# EAGLE design PCM2704_Test_v1 (EAGLE 6.4)
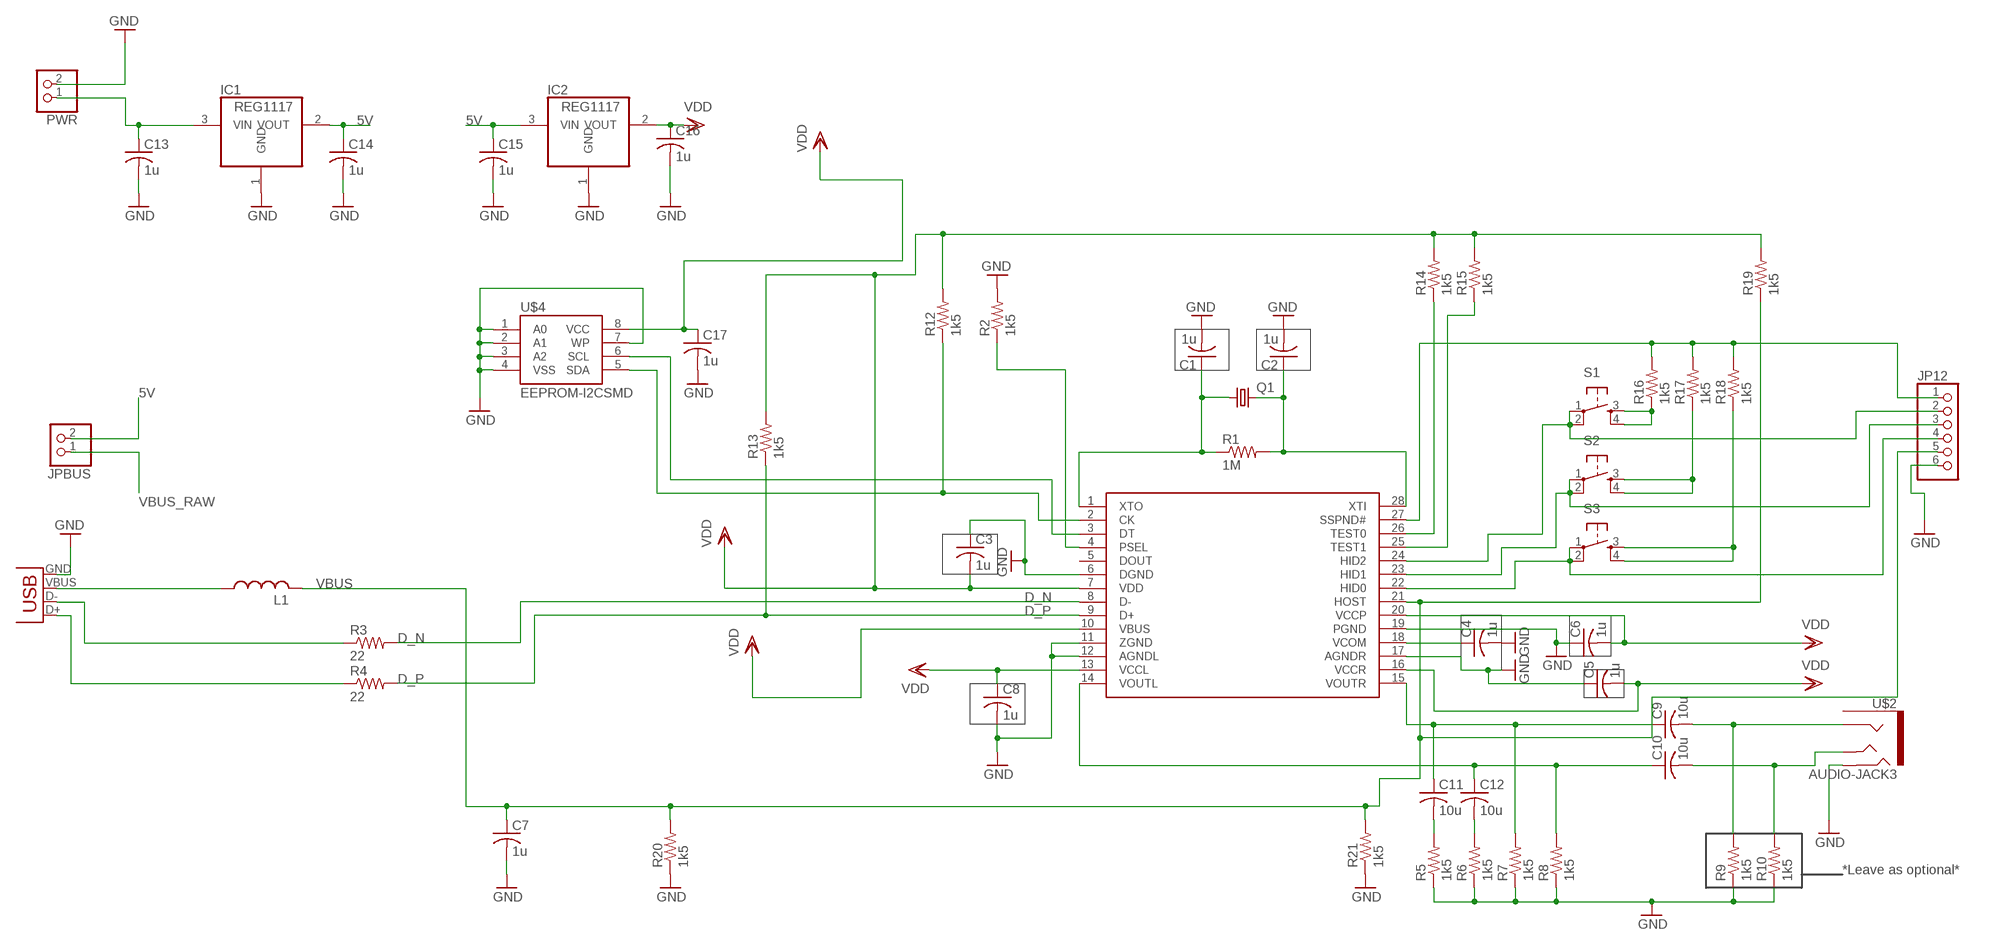
[diagram p0: schematic, sheet 1]

## Parts
C1  1u  C-USC0402  [C0402]
C2  1u  C-USC0402  [C0402]
C3  1u  C-USC0402  [C0402]
C4  1u  C-USC0402  [C0402]
C5  1u  C-USC0402  [C0402]
C6  1u  C-USC0402  [C0402]
C7  1u  C-USC0402  [C0402]
C8  1u  C-USC0402  [C0402]
C9  10u  C-USC0805  [C0805]
C10  10u  C-USC0805  [C0805]
C11  10u  C-USC0805  [C0805]
C12  10u  C-USC0805  [C0805]
C13  1u  C-USC0805  [C0805]
C14  1u  C-USC0805  [C0805]
C15  1u  C-USC0805  [C0805]
C16  1u  C-USC0805  [C0805]
C17  1u  C-USC0402  [C0402]
IC1  REG1117  [SOT223]
IC2  REG1117  [SOT223]
JP12  PINHD-1X6  [1X06]
JPBUS  PINHD-1X2  [1X02]
L1  L-USL3225M  [L3225M]
PWR  PINHD-1X2  [1X02]
Q1  CRYSTALHC49US  [HC49US]
R1  1M  R-US_R0603  [R0603]
R2  1k5  R-US_R0603  [R0603]
R3  22  R-US_R0603  [R0603]
R4  22  R-US_R0603  [R0603]
R5  1k5  R-US_R0805  [R0805]
R6  1k5  R-US_R0805  [R0805]
R7  1k5  R-US_R0805  [R0805]
R8  1k5  R-US_R0805  [R0805]
R9  1k5  R-US_R0805  [R0805]
R10  1k5  R-US_R0805  [R0805]
R12  1k5  R-US_R0603  [R0603]
R13  1k5  R-US_R0603  [R0603]
R14  1k5  R-US_R0603  [R0603]
R15  1k5  R-US_R0603  [R0603]
R16  1k5  R-US_R0603  [R0603]
R17  1k5  R-US_R0603  [R0603]
R18  1k5  R-US_R0603  [R0603]
R19  1k5  R-US_R0603  [R0603]
R20  1k5  R-US_R0603  [R0603]
R21  1k5  R-US_R0603  [R0603]
S1  TAC_SWITCHSMD  [TACTILE_SWITCH_SMD]
S2  TAC_SWITCHSMD  [TACTILE_SWITCH_SMD]
S3  TAC_SWITCHSMD  [TACTILE_SWITCH_SMD]
U$1  PCM2704C  [PCM2704C]
U$2  AUDIO-JACK3  [AUDIO-JACK-TRRS-SMD]
U$4  EEPROM-I2CSMD  [SO08]
X1  USB-MB-S  [USB-MB-S]

## Nets
5V: C14.1 C15.1 IC1.2(VOUT) IC2.3(VIN) JPBUS.2
D_N: R3.2 U$1.8(D-)
D_P: R4.2 R13.1 U$1.9(D+)
GND: C1.2 C2.2 C3.1 C4.2 C5.1 C6.1 C7.2 C8.2 C13.2 C14.2 C15.2 C16.2 C17.2 IC1.1(GND) IC2.1(GND) JP12.6 PWR.2 R2.2 R5.1 R6.1 R7.1 R8.1 R9.1 R10.1 R20.1 R21.1 U$1.6(DGND) U$1.11(ZGND) U$1.12(AGNDL) U$1.17(AGNDR) U$1.19(PGND) U$2.RING2 U$4.1(A0) U$4.2(A1) U$4.3(A2) U$4.4(VSS) U$4.7(WP) X1.GND
HP_OUT_L: C10.2 R10.2 U$2.TIP
HP_OUT_R: C9.2 R9.2 U$2.RING1
N$1: C1.1 Q1.1 R1.1 U$1.1(XTO)
N$2: C2.1 Q1.2 R1.2 U$1.28(XTI)
N$5: R2.1 U$1.4(PSEL)
N$8: R16.1 S1.3 S1.4
N$10: R17.1 S2.3 S2.4
N$11: R18.1 S3.3 S3.4
N$14: R14.1 U$1.26(TEST0)
N$15: R15.1 U$1.25(TEST1)
N$16: R12.1 U$1.2(CK) U$4.5(SDA)
N$17: U$1.3(DT) U$4.6(SCL)
N$18: C4.1 U$1.18(VCOM)
N$19: C11.2 R5.2
N$20: C12.2 R6.2
N$22: JP12.4 S3.1 S3.2 U$1.22(HID0)
N$23: JP12.3 S2.1 S2.2 U$1.23(HID1)
N$24: JP12.2 S1.1 S1.2 U$1.24(HID2)
SSPND: JP12.1 R16.2 R17.2 R18.2 U$1.27(SSPND#)
USB_D_N: R3.1 X1.D-
USB_D_P: R4.1 X1.D+
VBUS: C7.1 JP12.5 L1.2 R19.1 R20.2 R21.2 U$1.21(HOST)
VBUS_RAW: JPBUS.1 L1.1 X1.VBUS
VDD: C3.2 C5.2 C6.2 C8.1 C16.1 C17.1 IC2.2(VOUT) R12.2 R13.2 R14.2 R15.2 R19.2 U$1.7(VDD) U$1.10(VBUS) U$1.13(VCCL) U$1.16(VCCR) U$1.20(VCCP) U$4.8(VCC)
VIN: C13.1 IC1.3(VIN) PWR.1
VOUTL: C10.1 C12.1 R8.2 U$1.14(VOUTL)
VOUTR: C9.1 C11.1 R7.2 U$1.15(VOUTR)
Unconnected: U$1.5(DOUT) U$2.EARTH

## Notes on the sheet
- *Leave as optional*

## Library data of the parts
C1-C17 = rcl:C-US: CAPACITOR, American symbol
IC1 IC2 = burr-brown-3:REG1117: 800mA and 1A Low Dropout (LDO) Positive Regulator 1.8V, 2.5V, 2.85V, 3.3V, 5V, and Adj
JP12 = pinhead:PINHD-1X6: PIN HEADER
JPBUS PWR = pinhead:PINHD-1X2: PIN HEADER
L1 = rcl:L-US: INDUCTOR, American symbol
Q1 = SparkFun-FreqCtrl:CRYSTAL: Various standard crystals. Proven footprints. Spark Fun Electronics SKU : COM-00534
R1-R10 R12-R21 = rcl:R-US_: RESISTOR, American symbol
S1-S3 = SparkFun:TAC_SWITCH: Momentary Switch Button commonly used for reset or general input. Spark Fun Electronics SKU : COM-00097
U$1 = pcm2704c:PCM2704C
U$2 = SparkFun-Connectors:AUDIO-JACK3: Audio jack - 3.5mm TRRS variety - two rings.
U$4 = SparkFun:EEPROM-I2C
X1 = con-usb:USB: USB Connectors

## Board
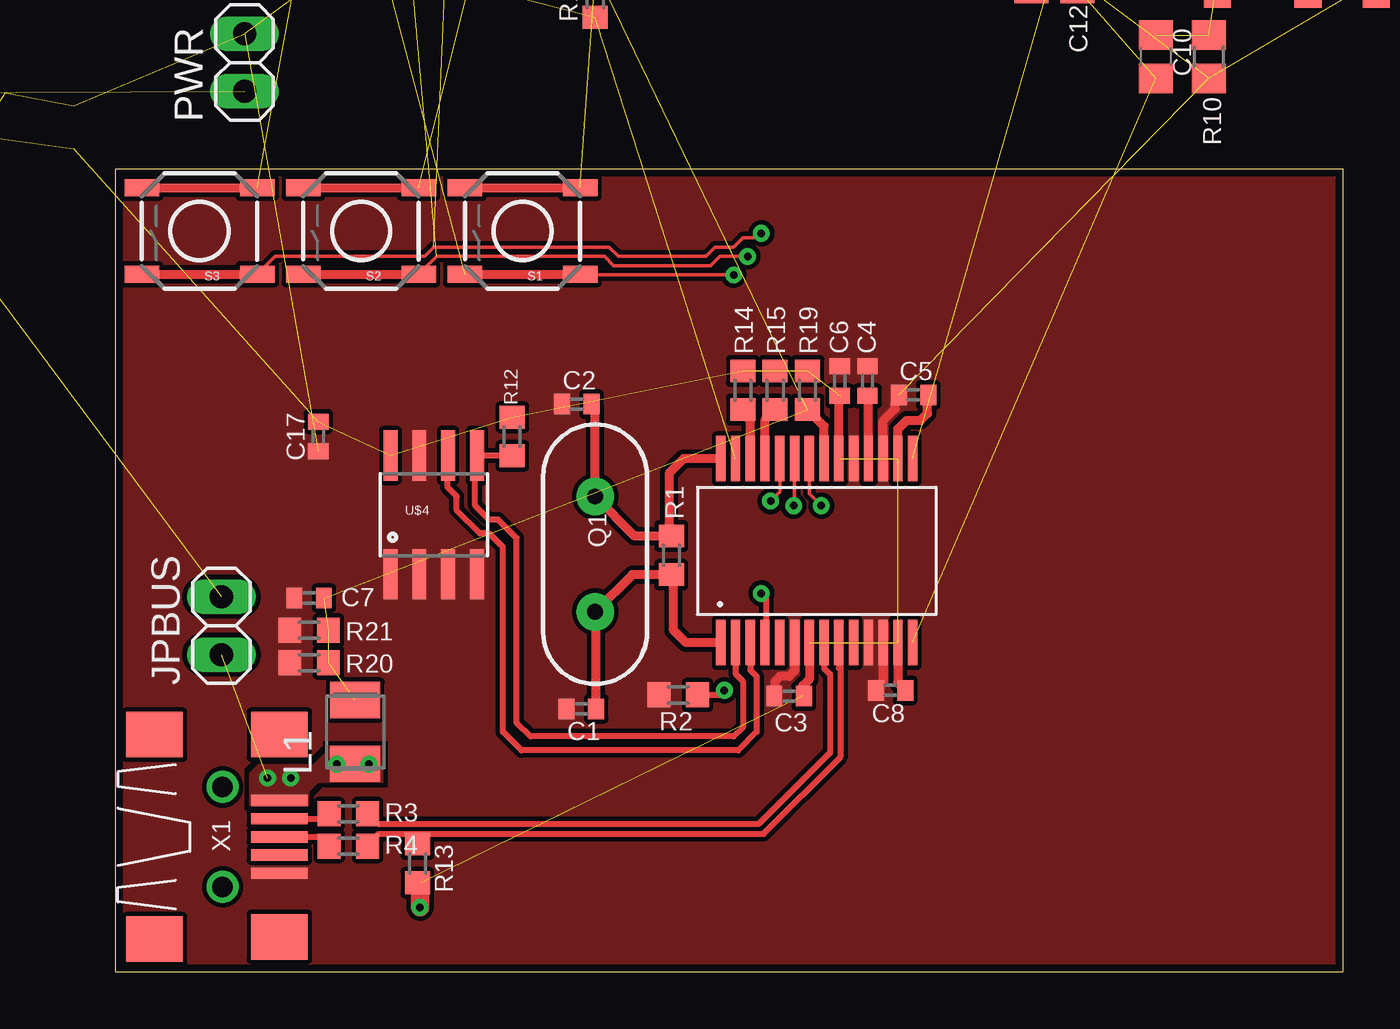
[diagram p1: board, top side]
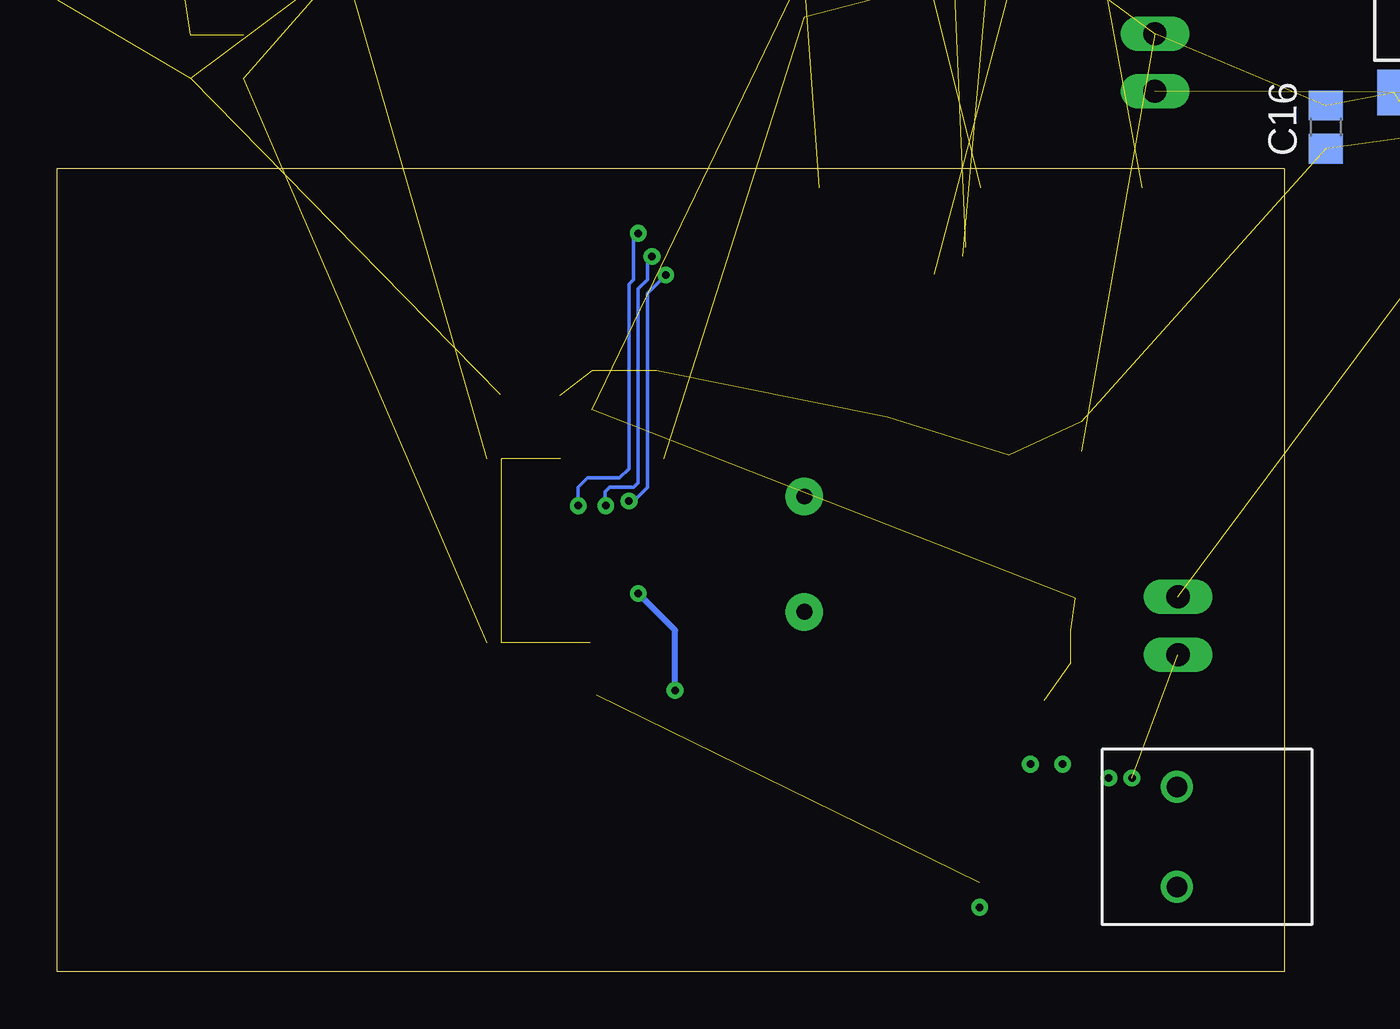
[diagram p2: board, bottom side, seen from below]

Size 54.05 x 35.36 mm. Coordinates in mm from the lower left corner, seen from the top.
Outline: 0,0 54.05,0 54.05,35.36 0,35.36 0,0
Copper layers (1*16): Top 0.035mm / dielectric 1.5mm / Bottom 0.035mm
Design rules "default *": minimum track width 10mil, minimum drill 24mil, track to track 8mil, track to pad 8mil, pad to pad 8mil, via to via 8mil, smd to smd 8mil, copper to edge 13mil, drill to drill 8mil, minimum pad ring 10mil, minimum via ring 8mil, stop-mask expansion 4mil, vias tented up to drill 0mil, thermal gap 10mil

### Footprints (pad centres in the part's own frame; a part is rotated, then mirrored left to right if it is on the bottom)
C0402 = smd 0.7 x 0.9: 1 -0.65,0; 2 0.65,0
C0805 = smd 1.3 x 1.5: 1 -0.95,0; 2 0.95,0
SOT223 = smd 1.499 x 2.007: 1 -2.261,-3.15; 2 0.025,-3.15; 3 2.311,-3.15 | smd 3.81 x 2.007: 4 0,3.15
1X06 = drill 1.016 long: 1 -6.35,0; 2 -3.81,0; 3 -1.27,0; 4 1.27,0; 5 3.81,0; 6 6.35,0
1X02 = drill 1.016 long: 1 -1.27,0; 2 1.27,0
L3225M = smd 1.6 x 2.2: 1 -1.4,0; 2 1.4,0
HC49US = drill 0.7 pad 1.651: 1 -2.54,0; 2 2.54,0
R0603 = smd 1 x 1.1: 1 -0.85,0; 2 0.85,0
R0805 = smd 1.3 x 1.5: 1 -0.95,0; 2 0.95,0
TACTILE_SWITCH_SMD = smd 1.524 x 0.762: 1 -2.54,1.905; 2 2.54,1.905; 3 -2.54,-1.905; 4 2.54,-1.905
PCM2704C = smd 0.41 x 2: 1 -4.225,-4.05; 2 -3.575,-4.05; 3 -2.925,-4.05; 4 -2.275,-4.05; 5 -1.625,-4.05; 6 -0.975,-4.05; 7 -0.325,-4.05; 8 0.325,-4.05; 9 0.975,-4.05; 10 1.625,-4.05; 11 2.275,-4.05; 12 2.925,-4.05; 13 3.575,-4.05; 14 4.225,-4.05; 15 4.225,4.05; 16 3.575,4.05; 17 2.925,4.05; 18 2.275,4.05; 19 1.625,4.05; 20 0.975,4.05; 21 0.325,4.05; 22 -0.325,4.05; 23 -0.975,4.05; 24 -1.625,4.05; 25 -2.275,4.05; 26 -2.925,4.05; 27 -3.575,4.05; 28 -4.225,4.05
AUDIO-JACK-TRRS-SMD = smd 1.2 x 2.5: EARTH 11.3,-3.25; RING1 6.2,3.25; RING2 3.2,3.25; TIP 10.2,3.25 | hole 1.2: 1.6,0; 8.6,0
SO08 = smd 0.61 x 2.21: 1 -1.905,-2.616; 2 -0.635,-2.616; 3 0.635,-2.616; 4 1.905,-2.616; 5 1.905,2.616; 6 0.635,2.616; 7 -0.635,2.616; 8 -1.905,2.616
USB-MB-S = smd 2.5 x 0.5: D+ 2.5,0; D- 2.5,0.8; GND 2.5,-1.6; ID 2.5,-0.8; VBUS 2.5,1.6 | smd 2.5 x 2: P$1 -3,-4.5; P$2 -3,4.5; P$3 2.5,-4.4; P$4 2.5,4.5 | drill 0.9: P$5 0,2.2; P$6 0,-2.2

### Placement (x,y rotation side)
C1  20.52,11.58 180 top
C2  20.32,24.99 180 top
C3  29.67,12.14 0 top
C4  33.12,26.01 90 top
C5  35.15,25.4 0 top
C6  31.9,26.01 270 top
C7  8.53,16.46 180 top
C8  34.14,12.4 180 top
C9  52.98,52.63 270 top  (outside the outline)
C10  45.82,40.28 90 top  (outside the outline)
C11  46.02,55.07 90 top  (outside the outline)
C12  42.37,44.25 90 top  (outside the outline)
C13  -13.21,34.75 270 bottom  (outside the outline)
C14  -17.27,34.95 90 bottom  (outside the outline)
C15  -8.13,34.95 180 bottom  (outside the outline)
C16  -1.83,37.19 90 bottom
C17  8.94,23.57 270 top
IC1  -7.11,41.86 0 bottom  (outside the outline)
IC2  -19.71,41.86 0 bottom  (outside the outline)
JP12  13.61,51.82 0 top  (outside the outline)
JPBUS  4.67,15.24 90 top
L1  10.57,10.57 90 top
PWR  5.69,40.03 90 top  (outside the outline)
Q1  21.13,18.39 90 top
R1  24.49,18.34 90 top
R2  24.79,12.19 180 top
R3  10.26,6.96 0 top
R4  10.26,5.54 0 top
R5  48.97,55.88 180 top  (outside the outline)
R6  41.25,47.14 0 top  (outside the outline)
R7  44.2,55.07 270 top  (outside the outline)
R8  40.34,44.25 270 top  (outside the outline)
R9  50.04,51.31 0 top  (outside the outline)
R10  48.16,40.28 90 top  (outside the outline)
R12  17.48,23.57 90 top
R13  13.31,4.78 270 top
R14  27.64,25.6 90 top
R15  29.06,25.6 90 top
R16  21.13,42.88 270 top  (outside the outline)
R17  14.83,43.89 180 top  (outside the outline)
R18  7.11,43.89 180 top  (outside the outline)
R19  30.48,25.6 90 top
R20  8.53,13.61 0 top
R21  8.53,15.04 0 top
S1  17.93,32.61 180 top
S2  10.82,32.61 180 top
S3  3.71,32.61 180 top
U$1  30.89,18.54 0 top
U$2  58.72,46.94 180 top  (outside the outline)
U$4  14.02,20.12 0 top
X1  4.72,5.94 0 top

### Tracks (layer width: path | path; a pad name or v marks a point on that pad's centre or on a via)
5V  (4 unrouted)
D_N
  Top 0.254: U$1.8 31.21,13.37 31.47,13.11 31.47,9.64 28.35,6.53 11.58,6.53 11.38,6.69 R3.2
D_P
  Top 0.254: 13.41,6.07 11.58,6.07 11.38,5.8 R4.2 | 13.41,6.07 28.54,6.07 31.93,9.46 31.93,13.44 31.86,13.37 U$1.9 | R13.1 13.41,5.62 13.41,6.07
GND  (15 unrouted)
  Top 0.406: U$1.17 33.81,24.26 34.34,24.79 34.34,25.03 C5.1 | U$1.12 33.81,12.72 C8.2 | U$1.6 29.91,13.25 29.67,13.01 29.26,13.01 29.06,12.8 29.06,12.18 C3.1
  pour Top (rank 6, no thermals): 0.2,35.15 53.85,35.15 53.85,0.2 0.2,0.2
HP_OUT_L  (2 unrouted)
HP_OUT_R  (2 unrouted)
N$1
  Top 0.406: U$1.1 25.13,14.49 24.59,15.04 24.59,17.18 R1.1 22.77,17.49 Q1.1 21.17,15.81 C1.1
N$2
  Top 0.406: U$1.28 25.03,22.59 24.38,21.95 24.38,19.09 R1.2 22.87,19.19 Q1.2 21.13,24.83 C2.1
N$5  (via drill 0.33)
  Top 0.254: R2.1 26.62,12.19 v26.82,12.39 | v28.45,16.66 28.65,16.46 28.65,14.53 U$1.4
  Bottom 0.254: v26.82,12.39 26.82,15.04 v28.45,16.66
N$8  (1 unrouted)
  Top 0.406: S1.4 S1.3
N$10  (1 unrouted)
  Top 0.406: S2.4 S2.3
N$11  (1 unrouted)
  Top 0.406: S3.4 S3.3
N$14
  Top 0.406: U$1.26 27.96,24.22 R14.1
N$15
  Top 0.406: U$1.25 28.61,24.31 R15.1
N$16
  Top 0.254: R12.1 17.33,22.73 U$4.5 15.85,22.66 15.85,20.52 16.46,19.91 16.87,19.91 17.68,19.1 17.68,10.97 18.29,10.36 27.23,10.36 27.64,10.77 27.64,12.8 27.31,13.12 U$1.2
N$17
  Top 0.254: U$1.3 27.96,13.29 28.24,13.01 28.24,10.57 27.43,9.75 17.88,9.75 17.07,10.57 17.07,18.69 16.46,19.3 16.05,19.3 15.04,20.32 15.04,20.93 14.63,21.34 14.63,22.71 U$4.6
N$18
  Top 0.406: U$1.18 33.16,24.99 C4.1
N$19  (1 unrouted)
N$20  (1 unrouted)
N$22  (via drill 0.33)  (1 unrouted)
  Top 0.152: U$1.22 30.56,21.05 v31.09,20.52 | S3.1 7.04,31.5 13.61,31.5 14.02,31.9 21.74,31.9 22.15,31.5 26.01,31.5 26.42,31.9 27.23,31.9 27.64,32.31 28.24,32.31 v28.45,32.51
  Top 0.406: S3.2 S3.1
  Bottom 0.152: v31.09,20.52 31.09,21.34 30.68,21.74 29.26,21.74 28.85,22.15 28.85,30.28 28.65,30.48 28.65,32.31 v28.45,32.51
N$23  (via drill 0.33)  (1 unrouted)
  Top 0.152: U$1.23 29.91,20.56 v29.87,20.52 | v27.84,31.5 26.62,31.5 26.21,31.09 21.95,31.09 21.54,31.5 14.15,31.5 S2.1
  Top 0.406: S2.2 S2.1
  Bottom 0.152: v29.87,20.52 29.91,20.56 29.91,21.13 29.71,21.34 28.65,21.34 28.45,21.54 28.45,30.07 28.04,30.48 28.04,31.29 v27.84,31.5
N$24  (via drill 0.33)  (1 unrouted)
  Top 0.152: U$1.24 29.26,21.13 v28.85,20.73 | v27.23,30.68 20.5,30.68 S1.1
  Top 0.406: S1.2 S1.1
  Bottom 0.152: v28.85,20.73 28.65,20.73 28.04,21.34 28.04,29.87 v27.23,30.68
SSPND  (4 unrouted)
USB_D_N
  Top 0.254: X1.D- 9.41,6.74 R3.1
USB_D_P
  Top 0.254: X1.D+ 9.41,5.94 R4.1
VBUS  (5 unrouted)
  Top 0.406: U$1.21 31.21,24.02 R19.1
VBUS_RAW  (via drill 0.33)  (1 unrouted)
  other vias: 6.71,8.53 7.72,8.53 9.75,9.14 11.18,9.14
  pour Top (rank 5, no thermals): 5.89,7.32 8.53,7.32 8.53,7.92 8.94,8.33 11.79,8.33 11.79,9.96 9.35,9.96 9.35,9.75 8.74,9.14 6.3,9.14 5.89,8.74
VDD  (via drill 0.33)  (13 unrouted)
  Top 0.406: U$1.20 31.86,24.91 C6.2 | U$1.16 34.46,23.89 34.85,24.28 35.46,24.28 35.76,24.59 35.76,24.95 C5.2 | U$1.13 34.46,12.72 C8.1 | U$1.7 30.56,12.88 30.28,12.6 30.28,12.18 C3.2
  Top 0.813: R13.2 13.41,3.92 v13.41,2.84
VIN  (2 unrouted)
VOUTL  (3 unrouted)
VOUTR  (3 unrouted)